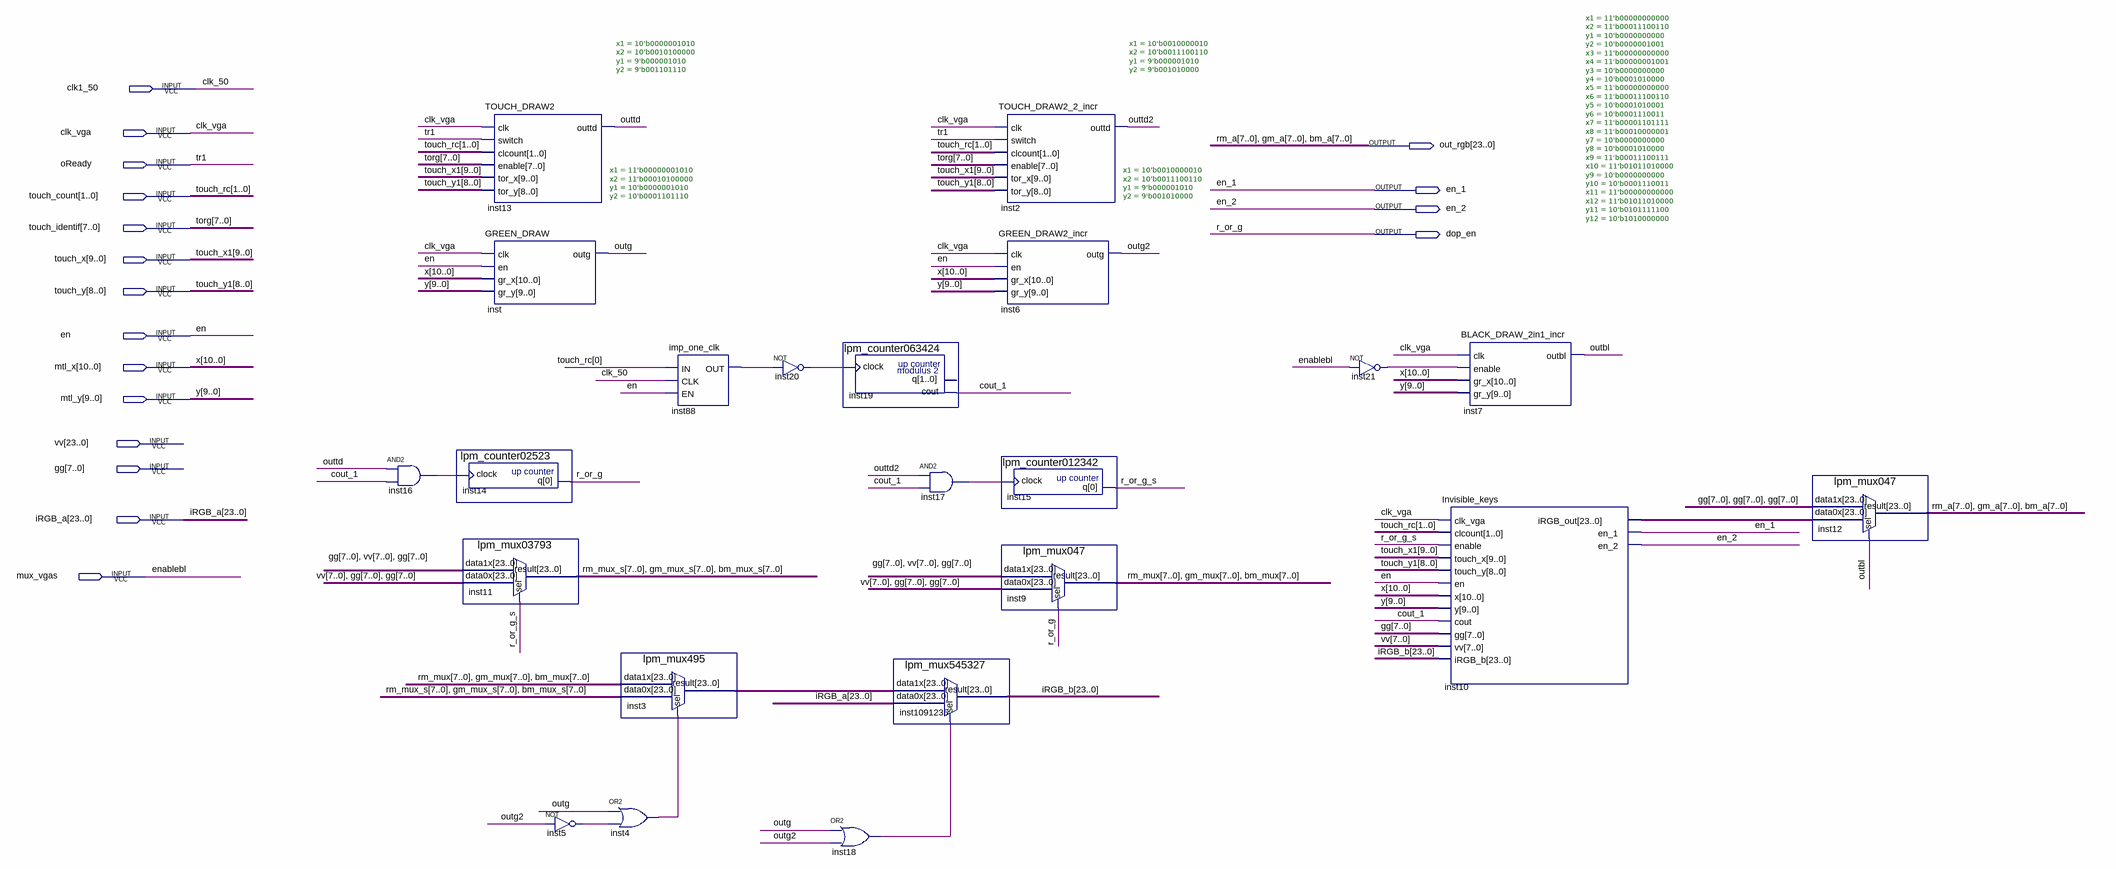
[diagram p0: schematic sheet]
// Quartus schematic keys_3.bdf as structural Verilog: 22 symbols, 18 pins
module keys_3 (
  input  clk1_50,
  input  clk_vga,
  input  oReady,
  input  [1:0] touch_count,
  input  [7:0] touch_identif,
  input  [9:0] touch_x,
  input  [8:0] touch_y,
  input  en,
  input  [10:0] mtl_x,
  input  [9:0] mtl_y,
  input  [23:0] vv,
  input  [7:0] gg,
  input  [23:0] iRGB_a,
  input  mux_vgas,
  output [23:0] out_rgb,
  output en_1,
  output en_2,
  output dop_en
);

  wire cout_1, inst4_out, inst5_out, inst16_out, inst17_out, inst18_out, inst20_out, inst21_out, inst88_out,
       outbl, outg, outg2, outtd, outtd2, r_or_g_s;
  wire [7:0] bm_mux, bm_mux_s, gm_mux, gm_mux_s, rm_mux, rm_mux_s;
  wire [23:0] inst3_result, inst10_irgb_out, iRGB_b;

  and inst16 (inst16_out, outtd, cout_1);
  TOUCH_DRAW2 #(.x1(10'b0000001010), .x2(10'b0010100000), .y1(9'b000001010), .y2(9'b001101110)) inst13 (
    .clk(clk_vga), .switch(oReady), .clcount(touch_count), .enable(touch_identif), .tor_x(touch_x),
    .tor_y(touch_y), .outtd(outtd));
  GREEN_DRAW #(.x1(11'b00000001010), .x2(11'b00010100000), .y1(10'b0000001010), .y2(10'b0001101110)) inst (
    .clk(clk_vga), .en(en), .gr_x(mtl_x), .gr_y(mtl_y), .outg(outg));
  lpm_counter02523 inst14 (.clock(inst16_out), .q(dop_en));
  lpm_mux03793 inst11 (
    .data1x({gg, vv[7:0], gg}), .data0x({vv[7:0], gg, gg}), .sel(r_or_g_s),
    .result({rm_mux_s, gm_mux_s, bm_mux_s}));
  not inst5 (inst5_out, outg2);
  lpm_mux495 inst3 (
    .data1x({rm_mux, gm_mux, bm_mux}), .data0x({rm_mux_s, gm_mux_s, bm_mux_s}), .sel(inst4_out),
    .result(inst3_result));
  or inst4 (inst4_out, outg, inst5_out);
  imp_one_clk inst88 (.IN(touch_count[0]), .CLK(clk1_50), .EN(en), .OUT(inst88_out));
  not inst20 (inst20_out, inst88_out);
  lpm_counter063424 inst19 (.clock(inst20_out), .cout(cout_1));  // open: q
  or inst18 (inst18_out, outg, outg2);
  lpm_mux545327 inst1091235 (.data1x(inst3_result), .data0x(iRGB_a), .sel(inst18_out), .result(iRGB_b));
  and inst17 (inst17_out, outtd2, cout_1);
  TOUCH_DRAW2_2_incr #(.x1(10'b0010000010), .x2(10'b0011100110), .y1(9'b000001010), .y2(9'b001010000)) inst2 (
    .clk(clk_vga), .switch(oReady), .clcount(touch_count), .enable(touch_identif), .tor_x(touch_x),
    .tor_y(touch_y), .outtd(outtd2));
  GREEN_DRAW2_incr #(.x1(10'b0010000010), .x2(10'b0011100110), .y1(9'b000001010), .y2(9'b001010000)) inst6 (
    .clk(clk_vga), .en(en), .gr_x(mtl_x), .gr_y(mtl_y), .outg(outg2));
  lpm_counter012342 inst15 (.clock(inst17_out), .q(r_or_g_s));
  lpm_mux047 inst9 (
    .data1x({gg, vv[7:0], gg}), .data0x({vv[7:0], gg, gg}), .sel(dop_en), .result({rm_mux, gm_mux, bm_mux}));
  not inst21 (inst21_out, mux_vgas);
  Invisible_keys inst10 (
    .clk_vga(clk_vga), .clcount(touch_count), .enable(r_or_g_s), .touch_x(touch_x), .touch_y(touch_y),
    .en(en), .x(mtl_x), .y(mtl_y), .cout(cout_1), .gg(gg), .vv(vv[7:0]), .iRGB_b(iRGB_b),
    .iRGB_out(inst10_irgb_out), .en_1(en_1), .en_2(en_2));
  BLACK_DRAW_2in1_incr #(.x1(11'b00000000000), .x2(11'b00011100110), .y1(10'b0000000000), .y2(10'b0000001001), .x3(11'b00000000000), .x4(11'b00000001001), .y3(10'b0000000000), .y4(10'b0001010000), .x5(11'b00000000000), .x6(11'b00011100110), .y5(10'b0001010001), .y6(10'b0001110011), .x7(11'b00001101111), .x8(11'b00010000001), .y7(10'b0000000000), .y8(10'b0001010000), .x9(11'b00011100111), .x10(11'b01011010000), .y9(10'b0000000000), .y10(10'b0001110011), .x11(11'b00000000000), .x12(11'b01011010000), .y11(10'b0101111100), .y12(10'b1010000000)) inst7 (
    .clk(clk_vga), .enable(inst21_out), .gr_x(mtl_x), .gr_y(mtl_y), .outbl(outbl));
  lpm_mux047 inst12 (.data1x({gg, gg, gg}), .data0x(inst10_irgb_out), .sel(outbl), .result(out_rgb));

  // Other names for the same wires on the sheet: bm_a[7:0] = out_rgb[7:0]; clk_50 = clk1_50; enablebl = mux_vgas;
  //   gm_a[7:0] = out_rgb[15:8]; r_or_g = dop_en; rm_a[7:0] = out_rgb[23:16]; torg[7:0] = touch_identif;
  //   touch_rc[1:0] = touch_count; touch_x1[9:0] = touch_x; touch_y1[8:0] = touch_y; tr1 = oReady; x[10:0] = mtl_x;
  //   y[9:0] = mtl_y
endmodule
